# Altium schematic sheet hierarchy.SchDoc
size A2; DocumentNumber: 1; SheetNumber: 1; SheetTotal: 24; SheetDescription: Structure of Master
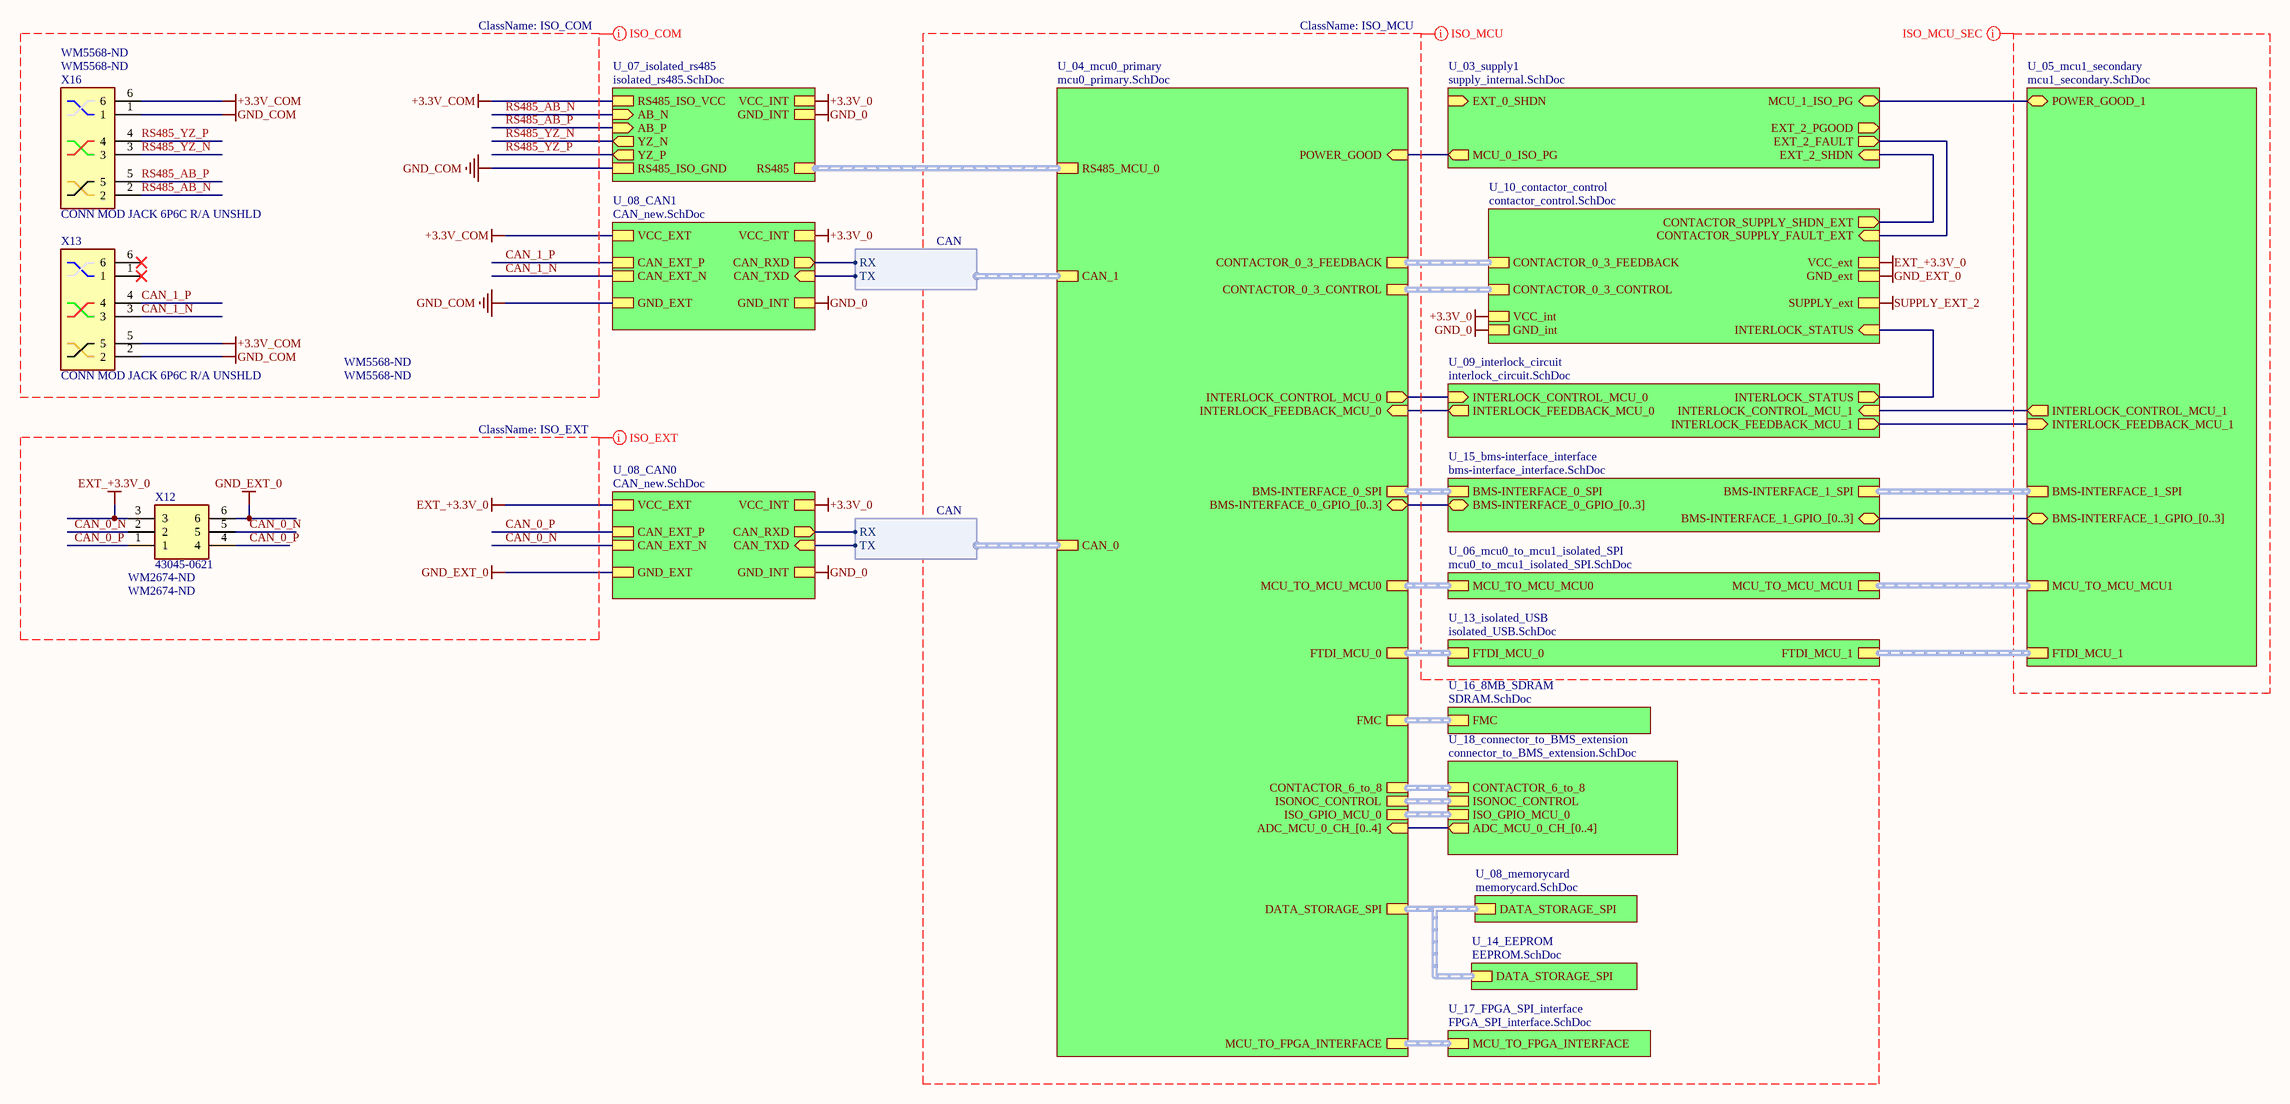
[diagram p0: hierarchy.SchDoc]

## Parts
X12  43045-0621  Supplier Part Number 1: WM2674-ND  [43045-0621]
X13  CONN MOD JACK 6P6C R/A UNSHLD  Supplier Part Number 1: WM5568-ND  [95501-2661]
X16  CONN MOD JACK 6P6C R/A UNSHLD  Supplier Part Number 1: WM5568-ND  [95501-2661]

## Sub-sheets
U_03_supply1 = supply_internal.SchDoc: EXT_2_FAULT (out), MCU_1_ISO_PG (bidir), EXT_0_SHDN (in), EXT_2_PGOOD (out), EXT_2_SHDN (in), MCU_0_ISO_PG (out)
U_04_mcu0_primary = mcu0_primary.SchDoc: MCU_TO_FPGA_INTERFACE (harness SPI), FMC (harness FMC), CAN_1 (harness CAN), CAN_0 (harness CAN), MCU_TO_MCU_MCU0 (harness SPI), FTDI_MCU_0 (harness FTDI), CONTACTOR_6_to_8 (harness CONTACTOR_6_to_8), INTERLOCK_FEEDBACK_MCU_0 (in), INTERLOCK_CONTROL_MCU_0 (out), DATA_STORAGE_SPI (harness DATA_STORAGE_SPI), CONTACTOR_0_3_CONTROL (harness CONTACTOR_0_TO_3), CONTACTOR_0_3_FEEDBACK (harness CONTACTOR_0_TO_3_FEEDBACK), BMS-INTERFACE_0_SPI (harness SPI), BMS-INTERFACE_0_GPIO_[0..3] (bidir, harness CAN), ADC_MCU_0_CH_[0..4] (in), RS485_MCU_0 (harness RS485), ISONOC_CONTROL (harness ISONOC_CONTROL), ISO_GPIO_MCU_0 (harness ISO_GPIO), POWER_GOOD (in)
U_05_mcu1_secondary = mcu1_secondary.SchDoc: INTERLOCK_FEEDBACK_MCU_1 (in), INTERLOCK_CONTROL_MCU_1 (out), FTDI_MCU_1 (harness FTDI), MCU_TO_MCU_MCU1 (harness SPI), BMS-INTERFACE_1_SPI (harness SPI), BMS-INTERFACE_1_GPIO_[0..3] (bidir), POWER_GOOD_1 (bidir)
U_06_mcu0_to_mcu1_isolated_SPI = mcu0_to_mcu1_isolated_SPI.SchDoc: MCU_TO_MCU_MCU0 (harness SPI), MCU_TO_MCU_MCU1 (harness SPI)
U_07_isolated_rs485 = isolated_rs485.SchDoc: RS485 (harness RS485), RS485_ISO_GND, RS485_ISO_VCC, YZ_P (out), AB_N (in), AB_P (in), YZ_N (out), VCC_INT, GND_INT
U_08_CAN0 = CAN_new.SchDoc: VCC_EXT, CAN_EXT_P, CAN_EXT_N, GND_EXT, CAN_TXD (in), CAN_RXD (out), GND_INT, VCC_INT
U_08_CAN1 = CAN_new.SchDoc: VCC_EXT, CAN_EXT_P, CAN_EXT_N, GND_EXT, CAN_TXD (in), CAN_RXD (out), GND_INT, VCC_INT
U_08_memorycard = memorycard.SchDoc: DATA_STORAGE_SPI (harness DATA_STORAGE_SPI)
U_09_interlock_circuit = interlock_circuit.SchDoc: INTERLOCK_CONTROL_MCU_1 (in), INTERLOCK_FEEDBACK_MCU_0 (out), INTERLOCK_FEEDBACK_MCU_1 (out), INTERLOCK_CONTROL_MCU_0 (in), INTERLOCK_STATUS (out)
U_10_contactor_control = contactor_control.SchDoc: SUPPLY_ext, GND_ext, GND_int, VCC_int, VCC_ext, CONTACTOR_0_3_CONTROL (harness CONTACTOR_0_TO_3), CONTACTOR_0_3_FEEDBACK (harness CONTACTOR_0_TO_3_FEEDBACK), CONTACTOR_SUPPLY_FAULT_EXT (in), CONTACTOR_SUPPLY_SHDN_EXT (out), INTERLOCK_STATUS (in)
U_13_isolated_USB = isolated_USB.SchDoc: FTDI_MCU_0 (harness FTDI), FTDI_MCU_1 (harness FTDI)
U_14_EEPROM = EEPROM.SchDoc: DATA_STORAGE_SPI (harness DATA_STORAGE_SPI)
U_15_bms-interface_interface = bms-interface_interface.SchDoc: BMS-INTERFACE_0_SPI (harness SPI), BMS-INTERFACE_1_SPI (harness SPI), BMS-INTERFACE_0_GPIO_[0..3] (bidir), BMS-INTERFACE_1_GPIO_[0..3] (bidir)
U_16_8MB_SDRAM = SDRAM.SchDoc: FMC (harness FMC)
U_17_FPGA_SPI_interface = FPGA_SPI_interface.SchDoc: MCU_TO_FPGA_INTERFACE (harness SPI)
U_18_connector_to_BMS_extension = connector_to_BMS_extension.SchDoc: CONTACTOR_6_to_8 (harness CONTACTOR_6_to_8), ADC_MCU_0_CH_[0..4] (out), ISONOC_CONTROL (harness ISONOC_CONTROL), ISO_GPIO_MCU_0 (harness ISO_GPIO)

## Harnesses
CAN: RX, TX

## Nets
+3.3V_0: sheet U_10_contactor_control/VCC_int, sheet U_07_isolated_rs485/VCC_INT, sheet U_08_CAN1/VCC_INT, sheet U_08_CAN0/VCC_INT
+3.3V_COM: X13.5 X16.6 ; sheet U_07_isolated_rs485/RS485_ISO_VCC, sheet U_08_CAN1/VCC_EXT
EXT_+3.3V_0: X12.3 ; sheet U_10_contactor_control/VCC_ext, sheet U_08_CAN0/VCC_EXT
GND_0: sheet U_10_contactor_control/GND_int, sheet U_07_isolated_rs485/GND_INT, sheet U_08_CAN1/GND_INT, sheet U_08_CAN0/GND_INT
GND_COM: X13.2 X16.1 ; sheet U_07_isolated_rs485/RS485_ISO_GND, sheet U_08_CAN1/GND_EXT
GND_EXT_0: X12.6 ; sheet U_10_contactor_control/GND_ext, sheet U_08_CAN0/GND_EXT
SUPPLY_EXT_2: sheet U_10_contactor_control/SUPPLY_ext
CAN_0_N: X12.2 X12.5 ; sheet U_08_CAN0/CAN_EXT_N
CAN_0_P: X12.1 X12.4 ; sheet U_08_CAN0/CAN_EXT_P
CAN_1_N: X13.3 ; sheet U_08_CAN1/CAN_EXT_N
CAN_1_P: X13.4 ; sheet U_08_CAN1/CAN_EXT_P
RS485_AB_N: X16.2 ; sheet U_07_isolated_rs485/AB_N
RS485_AB_P: X16.5 ; sheet U_07_isolated_rs485/AB_P
RS485_YZ_N: X16.3 ; sheet U_07_isolated_rs485/YZ_N
RS485_YZ_P: X16.4 ; sheet U_07_isolated_rs485/YZ_P
(unnamed): sheet U_03_supply1/EXT_2_FAULT, sheet U_10_contactor_control/CONTACTOR_SUPPLY_FAULT_EXT
(unnamed): sheet U_03_supply1/MCU_1_ISO_PG, sheet U_05_mcu1_secondary/POWER_GOOD_1
(unnamed): sheet U_03_supply1/EXT_2_SHDN, sheet U_10_contactor_control/CONTACTOR_SUPPLY_SHDN_EXT
(unnamed): sheet U_03_supply1/MCU_0_ISO_PG, sheet U_04_mcu0_primary/POWER_GOOD
(unnamed): sheet U_04_mcu0_primary/INTERLOCK_FEEDBACK_MCU_0, sheet U_09_interlock_circuit/INTERLOCK_FEEDBACK_MCU_0
(unnamed): sheet U_04_mcu0_primary/INTERLOCK_CONTROL_MCU_0, sheet U_09_interlock_circuit/INTERLOCK_CONTROL_MCU_0
(unnamed): sheet U_05_mcu1_secondary/INTERLOCK_FEEDBACK_MCU_1, sheet U_09_interlock_circuit/INTERLOCK_FEEDBACK_MCU_1
(unnamed): sheet U_05_mcu1_secondary/INTERLOCK_CONTROL_MCU_1, sheet U_09_interlock_circuit/INTERLOCK_CONTROL_MCU_1
(unnamed): sheet U_09_interlock_circuit/INTERLOCK_STATUS, sheet U_10_contactor_control/INTERLOCK_STATUS
(unnamed): sheet U_08_CAN1/CAN_TXD, sheet U_04_mcu0_primary/CAN_1.TX
(unnamed): sheet U_08_CAN1/CAN_RXD, sheet U_04_mcu0_primary/CAN_1.RX
(unnamed): sheet U_08_CAN0/CAN_TXD, sheet U_04_mcu0_primary/CAN_0.TX
(unnamed): sheet U_08_CAN0/CAN_RXD, sheet U_04_mcu0_primary/CAN_0.RX

Not connected (* = marked no-connect by the designer): X13 1* 6*

## Buses and harness runs
bus sheet U_04_mcu0_primary/ADC_MCU_0_CH_[0..4] = sheet U_18_connector_to_BMS_extension/ADC_MCU_0_CH_[0..4]
bus sheet U_05_mcu1_secondary/BMS-INTERFACE_1_GPIO_[0..3] = sheet U_15_bms-interface_interface/BMS-INTERFACE_1_GPIO_[0..3]
harness sheet U_04_mcu0_primary/BMS-INTERFACE_0_SPI = sheet U_15_bms-interface_interface/BMS-INTERFACE_0_SPI
harness sheet U_04_mcu0_primary/CONTACTOR_0_3_CONTROL = sheet U_10_contactor_control/CONTACTOR_0_3_CONTROL
harness sheet U_04_mcu0_primary/CONTACTOR_0_3_FEEDBACK = sheet U_10_contactor_control/CONTACTOR_0_3_FEEDBACK
harness sheet U_04_mcu0_primary/CONTACTOR_6_to_8 = sheet U_18_connector_to_BMS_extension/CONTACTOR_6_to_8
harness sheet U_04_mcu0_primary/DATA_STORAGE_SPI = sheet U_08_memorycard/DATA_STORAGE_SPI = sheet U_14_EEPROM/DATA_STORAGE_SPI
harness sheet U_04_mcu0_primary/FMC = sheet U_16_8MB_SDRAM/FMC
harness sheet U_04_mcu0_primary/FTDI_MCU_0 = sheet U_13_isolated_USB/FTDI_MCU_0
harness sheet U_04_mcu0_primary/ISO_GPIO_MCU_0 = sheet U_18_connector_to_BMS_extension/ISO_GPIO_MCU_0
harness sheet U_04_mcu0_primary/ISONOC_CONTROL = sheet U_18_connector_to_BMS_extension/ISONOC_CONTROL
harness sheet U_04_mcu0_primary/MCU_TO_FPGA_INTERFACE = sheet U_17_FPGA_SPI_interface/MCU_TO_FPGA_INTERFACE
harness sheet U_04_mcu0_primary/MCU_TO_MCU_MCU0 = sheet U_06_mcu0_to_mcu1_isolated_SPI/MCU_TO_MCU_MCU0
harness sheet U_04_mcu0_primary/RS485_MCU_0 = sheet U_07_isolated_rs485/RS485
harness sheet U_05_mcu1_secondary/BMS-INTERFACE_1_SPI = sheet U_15_bms-interface_interface/BMS-INTERFACE_1_SPI
harness sheet U_05_mcu1_secondary/FTDI_MCU_1 = sheet U_13_isolated_USB/FTDI_MCU_1
harness sheet U_05_mcu1_secondary/MCU_TO_MCU_MCU1 = sheet U_06_mcu0_to_mcu1_isolated_SPI/MCU_TO_MCU_MCU1

## Layout directives
net class ISO_MCU: +3.3V_0, EXT_+3.3V_0, GND_0, GND_EXT_0, SUPPLY_EXT_2
net class ISO_MCU_SEC: (no net found under the mark)
net class ISO_COM: +3.3V_COM, CAN_1_N, CAN_1_P, GND_COM, RS485_AB_N, RS485_AB_P, RS485_YZ_N, RS485_YZ_P
net class ISO_EXT: CAN_0_N, CAN_0_P, EXT_+3.3V_0, GND_EXT_0

## Notes on the sheet
- Title
- Size:
- Date:
- File:
- A2
- Number:
- Time:
- Revision:
- Sheet
- of

## Library data of the parts
X12 = 43045-0621: Micro-Fit 3.0 Right Angle Header, 3.00mm Pitch, Dual Row, 6 Circuits, with Snap-in Plastic Peg PCB Lock, Tin, Glow Wire Capable, Black, 43045-0621; Manufacturer_Name: Molex; Part Name: MicroFit; Circuits: 6; Datasheet Link: http://www.molex.com/webdocs/datasheets/pdf/en-us//0430450621_PCB_HEADERS.pdf; Height: 8mm; Manufacturer_Part_Number: 43045-0621; Mouser Part Number: 538-43045-0621; Mouser Price/Stock: https://www.mouser.com/Search/Refine.aspx?Keyword=538-43045-0621; RS Part Number: 6700380; RS Price/Stock: https://uk.rs-online.com/web/p/products/6700380; Supplier 1: Digi-Key; Supplier 2: Digi-Key; Supplier Part Number 2: WM2674-ND
X13 X16 = 95501-2661: Jack Modular Connector 6p6c (RJ9, RJ10, RJ22) 90° Angle (Right) Unshielded Cat3; Manufacturer_Name: Molex; Manufacturer_Part_Number: 95501-2441; Allied_Number: 70372436; Datasheet Link: http://www.molex.com/webdocs/datasheets/pdf/en-us/0955012441_MODULAR_JACKS_PLUG.pdf; Mouser Part Number: 538-95501-2441; Mouser Price/Stock: https://www.mouser.com/Search/Refine.aspx?Keyword=538-95501-2441; RS Part Number: 2400913; RS Price/Stock: https://uk.rs-online.com/web/p/products/2400913; Allied Price/Stock: http://www.alliedelec.com/molex-incorporated-95501-2441/70372436/; Supplier 1: Digi-Key; Supplier 2: Digi-Key; Supplier Part Number 2: WM5568-ND